# Altium schematic sheet Sallen_key_LPF.SchDoc
size A
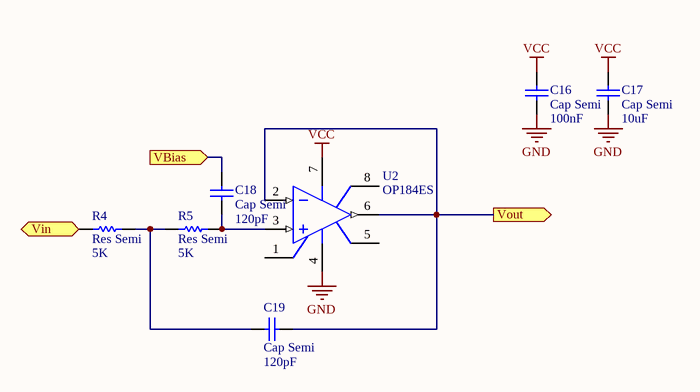
[diagram p0: Sallen_key_LPF.SchDoc]

## Parts
C16  Cap Semi  value 100nF  [C0805]
C17  Cap Semi  value 10uF  [C0805]
C18  Cap Semi  value 120pF  [C0805]
C19  Cap Semi  value 120pF  [C0805]
R4  Res Semi  value 5K  [6-0805_M]
R5  Res Semi  value 5K  [6-0805_M]
U2  OP184ES  [SO-8]

## Ports
VBias (in), Vin, Vout (out)

## Nets
GND: C16.1 C17.1 U2.4(V-)
VCC: C16.2 C17.2 U2.7(V+)
VBias: C18.2 ; port VBias
Vin: R4.1 ; port Vin
Vout: C19.1 U2.2(IN-) U2.6(OUT) ; port Vout
NetC18_1: C18.1 R5.2 U2.3(IN+)
NetC19_2: C19.2 R4.2 R5.1

Not connected (* = marked no-connect by the designer): U2 1(NUL) 5(NUL) 8(NC)

## Library data of the parts
C16-C19 = Cap Semi: Capacitor (Semiconductor SIM Model); Published: 8-Jun-2000; LatestRevisionDate: 29-May-2009; LatestRevisionNote: IPC-7351 Footprint Added.; PackageReference: C1206; Publisher: Altium Limited; PackageDescription: Chip Capacitor
R4 R5 = Res Semi: Semiconductor Resistor; Published: 8-Jun-2000; LatestRevisionDate: 17-Jul-2002; LatestRevisionNote: Re-released for DXP Platform.; PackageReference: AXIAL-0.5; Publisher: Altium Limited
U2 = OP184ES: Precision Rail-to-Rail Input and Ouput Operational Amplifier; Note: Pin 8 is not connected.; Published: 8-Jun-2000; LatestRevisionDate: 13-Apr-2006; LatestRevisionNote: IPC-7351 Footprint Added.; DatasheetVersion: REV. 0 1996; PackageVersion: revA; PackageReference: SO-8; Publisher: Altium Limited; PackageDescription: 8-Pin Small Outline Integrated Circuit 1.27 mm Pitch; Code_JEDEC: MS-012-AA; Code_IPC: SOIC127P600-8; ComponentLink1Description: Manufacturer Link; ComponentLink1URL: http://www.analog.com/en/prod/0,,759_786_OP184%2C00.html; ComponentLink2Description: Datasheet; ComponentLink2URL: http://www.analog.com/UploadedFiles/Data_Sheets/390492658OP184_284_484_b.pdf